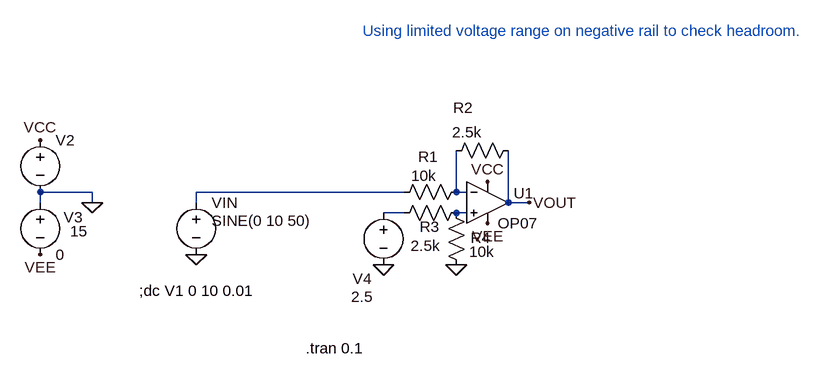
[diagram p0: schematic Draft03.asc]
Draft03.asc, the LTspice schematic file:
Version 4
SHEET 1 964 680
WIRE -192 80 -272 80
WIRE 288 80 -32 80
WIRE 368 80 368 16
WIRE 384 80 368 80
WIRE -272 96 -272 80
WIRE -192 96 -192 80
WIRE -32 96 -32 80
WIRE 448 96 448 16
WIRE 480 96 448 96
WIRE 288 112 256 112
WIRE 384 112 368 112
FLAG -32 176 0
FLAG -192 96 0
FLAG 480 96 VOUT
FLAG 256 192 0
FLAG 368 192 0
FLAG -272 0 VCC
FLAG 416 64 VCC
FLAG -272 176 VEE
FLAG 416 128 VEE
SYMBOL voltage -32 80 R0
WINDOW 123 0 0 Left 0
WINDOW 39 0 0 Left 0
WINDOW 3 24 44 Left 2
SYMATTR Value SINE(0 10 50)
SYMATTR InstName VIN
SYMBOL OpAmps\\OP07 416 32 R0
WINDOW 0 40 50 Left 2
SYMATTR InstName U1
SYMBOL voltage -272 -16 R0
WINDOW 123 0 0 Left 0
WINDOW 39 0 0 Left 0
WINDOW 3 46 156 Left 2
SYMATTR Value 15
SYMATTR InstName V2
SYMBOL voltage -272 80 R0
WINDOW 123 0 0 Left 0
WINDOW 39 0 0 Left 0
WINDOW 0 36 39 Left 2
SYMATTR InstName V3
SYMATTR Value 0
SYMBOL res 384 64 R90
WINDOW 0 -23 59 VBottom 2
WINDOW 3 -25 66 VTop 2
SYMATTR InstName R1
SYMATTR Value 10k
SYMBOL res 464 0 R90
WINDOW 0 -34 85 VBottom 2
WINDOW 3 -28 79 VTop 2
SYMATTR InstName R2
SYMATTR Value 2.5k
SYMBOL voltage 256 96 R0
WINDOW 0 -47 117 Left 2
WINDOW 3 -50 145 Left 2
WINDOW 123 0 0 Left 0
WINDOW 39 0 0 Left 0
SYMATTR InstName V4
SYMATTR Value 2.5
SYMBOL res 384 96 R90
WINDOW 0 53 57 VBottom 2
WINDOW 3 51 63 VTop 2
SYMATTR InstName R3
SYMATTR Value 2.5k
SYMBOL res 352 96 R0
WINDOW 0 38 54 Left 2
SYMATTR InstName R4
SYMATTR Value 10k
TEXT -120 232 Left 2 !;dc V1 0 10 0.01
TEXT 136 320 Left 2 !.tran 0.1
TEXT 224 -168 Left 2 ;Using limited voltage range on negative rail to check headroom.

The netlist it stands for:
* Draft03.asc
VIN N001 0 SINE(0 10 50)
XU1 N004 N002 VCC VEE VOUT LT1001  ; OP07, pins In+ In- V+ V- OUT
V2 VCC 0 15
V3 0 VEE 0
R1 N002 N001 10k
R2 VOUT N002 2.5k
V4 N003 0 2.5
R3 N004 N003 2.5k
R4 N004 0 10k
;dc V1 0 10 0.01
.tran 0.1
* Using limited voltage range on negative rail to check headroom.
.lib LTC.lib
.backanno
.end